# EAGLE design pcbremote (EAGLE 9.6.2)
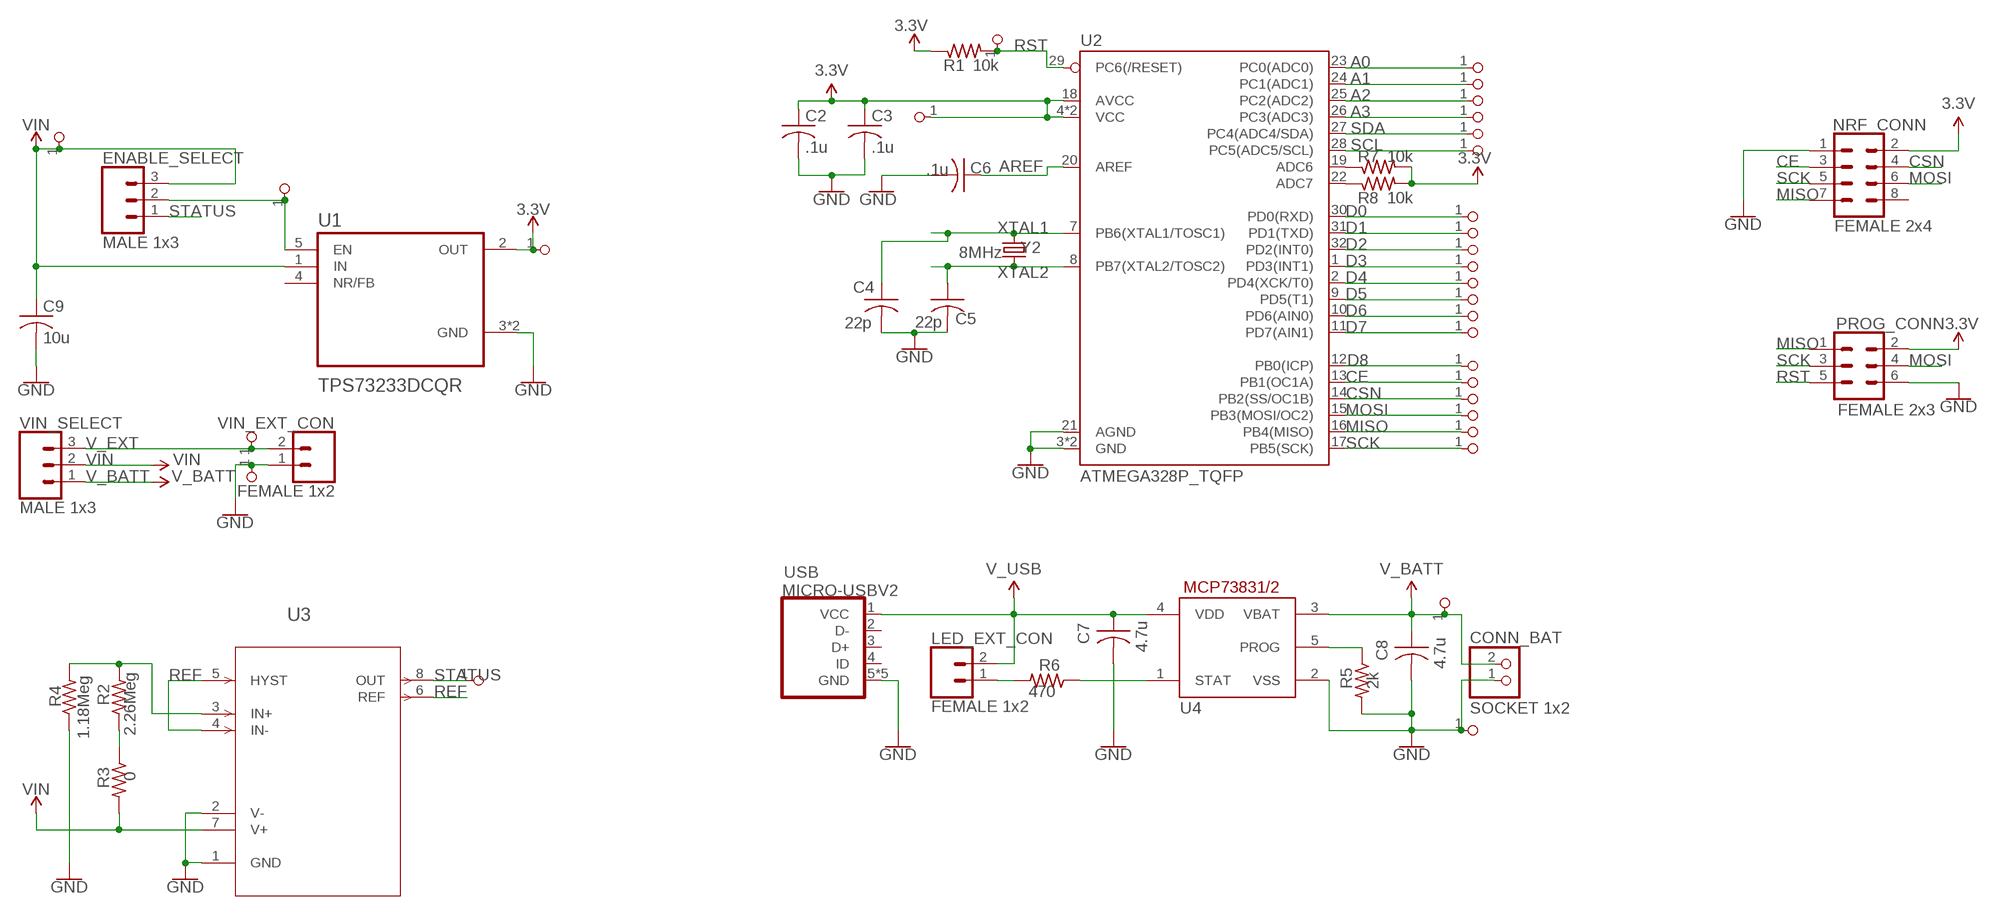
[diagram p0: schematic, sheet 1]

## Parts
3.3V  PINHD-1X1  [1X01]
A0  PINHD-1X1  [1X01]
A1  PINHD-1X1  [1X01]
A2  PINHD-1X1  [1X01]
A3  PINHD-1X1  [1X01]
C2  .1u  C-USC0805  [C0805]
C3  .1u  C-USC0805  [C0805]
C4  22p  C-USC0805  [C0805]
C5  22p  C-USC0805  [C0805]
C6  .1u  C-USC0805  [C0805]
C7  4.7u  C-USC0805  [C0805]
C8  4.7u  C-USC0805  [C0805]
C9  10u  C-USC0805  [C0805]
CE  PINHD-1X1  [1X01]
CONN_BAT  SOCKET 1x2  JST_2PIN-THM  [JST-PH-2-THM]
CSN  PINHD-1X1  [1X01]
D0  PINHD-1X1  [1X01]
D1  PINHD-1X1  [1X01]
D2  PINHD-1X1  [1X01]
D3  PINHD-1X1  [1X01]
D4  PINHD-1X1  [1X01]
D5  PINHD-1X1  [1X01]
D6  PINHD-1X1  [1X01]
D7  PINHD-1X1  [1X01]
D8  PINHD-1X1  [1X01]
EN  PINHD-1X1  [1X01]
ENABLE_SELECT  MALE 1x3  CONN_03  [1X03]
GND  PINHD-1X1  [1X01]
GND7  PINHD-1X1  [1X01]
LED_EXT_CON  FEMALE 1x2  CONN_02  [1X02]
MISO  PINHD-1X1  [1X01]
MOSI  PINHD-1X1  [1X01]
NRF_CONN  FEMALE 2x4  CONN_04X2  [2X4]
PROG_CONN  FEMALE 2x3  CONN_03X2FEMALE  [2X3]
R1  10k  R-US_R0805  [R0805]
R2  2.26Meg  R-US_R0805  [R0805]
R3  0  R-US_R0805  [R0805]
R4  1.18Meg  R-US_R0805  [R0805]
R5  2k  R-US_R0805  [R0805]
R6  470  R-US_R0805  [R0805]
R7  10k  R-US_R0805  [R0805]
R8  10k  R-US_R0805  [R0805]
RESET  PINHD-1X1  [1X01]
SCK  PINHD-1X1  [1X01]
SCL  PINHD-1X1  [1X01]
SDA  PINHD-1X1  [1X01]
STATUS  PINHD-1X1  [1X01]
U1  TPS73233DCQR  [SOT127P706X180-6N]
U2  ATMEGA328P_TQFP  [TQFP32-08]
U3  LTC1540CS8PBF  [SO-8_S_LIT]
U4  MCP73831/OT  [SOT23-5L]
USB  MICRO-USBV2  [MICRO-USB-2]
V_BATT  PINHD-1X1  [1X01]
VCC  PINHD-1X1  [1X01]
VIN  PINHD-1X1  [1X01]
VIN_EXT  PINHD-1X1  [1X01]
VIN_EXT_CON  FEMALE 1x2  CONN_02  [1X02]
VIN_SELECT  MALE 1x3  CONN_03  [1X03]
Y2  8MHz  CRYSTAL-8MHZSMD-5X3.2  [CRYSTAL-SMD-5X3.2-4PAD]

## Nets
3.3V: 3.3V.1 C2.1 C3.1 NRF_CONN.2 PROG_CONN.2 R1.1 R7.2 R8.2 U1.2(OUT) U2.4(VCC) U2.6(VCC) U2.18(AVCC) VCC.1
A0: A0.1 U2.23(PC0(ADC0))
A1: A1.1 U2.24(PC1(ADC1))
A2: A2.1 U2.25(PC2(ADC2))
A3: A3.1 U2.26(PC3(ADC3))
AREF: C6.1 U2.20(AREF)
CE: CE.1 NRF_CONN.3 U2.13(PB1(OC1A))
CSN: CSN.1 NRF_CONN.4 U2.14(PB2(SS/OC1B))
D0: D0.1 U2.30(PD0(RXD))
D1: D1.1 U2.31(PD1(TXD))
D2: D2.1 U2.32(PD2(INT0))
D3: D3.1 U2.1(PD3(INT1))
D4: D4.1 U2.2(PD4(XCK/T0))
D5: D5.1 U2.9(PD5(T1))
D6: D6.1 U2.10(PD6(AIN0))
D7: D7.1 U2.11(PD7(AIN1))
D8: D8.1 U2.12(PB0(ICP))
GND: C2.2 C3.2 C4.2 C5.2 C6.2 C7.2 C8.2 C9.2 CONN_BAT.1 GND7.1 GND.1 NRF_CONN.1 PROG_CONN.6 R4.1 R5.2 U1.3(GND) U1.6(GND) U2.3(GND) U2.5(GND) U2.21(AGND) U3.1(GND) U3.2(V-) U4.2(VSS) USB.5(GND) USB.P$1(GND) USB.P$2(GND) USB.P$3(GND) USB.P$4(GND) VIN_EXT_CON.1
MISO: MISO.1 NRF_CONN.7 PROG_CONN.1 U2.16(PB4(MISO))
MOSI: MOSI.1 NRF_CONN.6 PROG_CONN.4 U2.15(PB3(MOSI/OC2))
N$1: R2.2 R4.2 U3.3(IN+)
N$2: R2.1 R3.1
N$3: R5.1 U4.5(PROG)
N$4: R6.1 U4.1(STAT)
N$5: LED_EXT_CON.1 R6.2
N$6: R7.1 U2.19(ADC6)
N$7: R8.1 U2.22(ADC7)
N$8: EN.1 ENABLE_SELECT.2 U1.5(EN)
REF: U3.4(IN-) U3.5(HYST) U3.6(REF)
RST: PROG_CONN.5 R1.2 RESET.1 U2.29(PC6(/RESET))
SCK: NRF_CONN.5 PROG_CONN.3 SCK.1 U2.17(PB5(SCK))
SCL: SCL.1 U2.28(PC5(ADC5/SCL))
SDA: SDA.1 U2.27(PC4(ADC4/SDA))
STATUS: ENABLE_SELECT.1 STATUS.1 U3.8(OUT)
V_BATT: C8.1 CONN_BAT.2 U4.3(VBAT) V_BATT.1 VIN_SELECT.1
V_EXT: VIN_EXT.1 VIN_EXT_CON.2 VIN_SELECT.3
V_USB: C7.1 LED_EXT_CON.2 U4.4(VDD) USB.1(VCC)
VIN: C9.1 ENABLE_SELECT.3 R3.2 U1.1(IN) U3.7(V+) VIN.1 VIN_SELECT.2
XTAL1: C4.1 U2.7(PB6(XTAL1/TOSC1)) Y2.1
XTAL2: C5.1 U2.8(PB7(XTAL2/TOSC2)) Y2.3
Unconnected: NRF_CONN.8 U1.4(NR/FB) USB.2(D-) USB.3(D+) USB.4(ID)

## Library data of the parts
3.3V A0 A1-A3 CE CSN D0 D1-D8 EN GND GND7 MISO MOSI RESET SCK SCL SDA STATUS V_BATT VCC VIN VIN_EXT = pinhead:PINHD-1X1: PIN HEADER
C2-C9 = rcl:C-US: CAPACITOR, American symbol; SPICEPREFIX: C
CONN_BAT = adafruit:JST_2PIN: JST 2-Pin Connectors of various flavors SMT-RA (S2B-PH-SM4) 4UConnector #17311 SMT (B2B-PH-SM4) THM-RA (S2B-PH) THM (B2B-PH)
ENABLE_SELECT VIN_SELECT = SparkFun-Connectors:CONN_03: Multi connection point. Often used as Generic Header-pin footprint for 0.1 inch spaced/style header connections On any of the 0.1 inch spaced packages, you can populate with these: Break Away Headers - Straight <https://www.sparkfun.com/products/116> (PRT-00116) Break Away Male Headers - Right Angle <https://www.sparkfun.com/products/553> (PRT-00553) Female Headers <https://www.sparkfun.com/products/115> (PRT-00115) Break Away Headers - Machine Pin <https://www.sparkfun.com/products/117> (PRT-00117) Break Away Female Headers - Swiss Machine Pin <https://www.sparkfun.com/products/743> (PRT-00743) Stackable Header - 3 Pin (Female, 0.1") <https://www.sparkfun.com/products/13875> (PRT-13875) For SCREWTERMINALS and SPRING TERMINALS visit here: Screw Terimnals on SparkFun.com <https://www.sparkfun.com/search/results?term=Screw+Terminals> (5mm/3.5mm/2.54mm spacing) This device is also useful as a general connection point to wire up your design to another part of your project. Our various solder wires solder well into these plated through hole pads. Hook-Up Wire - Assortment (Stranded, 22 AWG) <https://www.sparkfun.com/products/11375> (PRT-11375) Hook-Up Wire - Assortment (Solid Core, 22 AWG) <https://www.sparkfun.com/products/11367> (PRT-11367) View the entire wire category on our website here <https://www.sparkfun.com/categories/141> Special notes: Molex polarized connector foot print use with SKU : PRT-08232 with associated crimp pins and housings.; PROD_ID: XXX-00000; VALUE: 455-1750-1-ND
LED_EXT_CON VIN_EXT_CON = SparkFun-Retired:CONN_02: Multi connection point. Often used as Generic Header-pin footprint for 0.1 inch spaced/style header connections On any of the 0.1 inch spaced packages, you can populate with these: Break Away Headers - Straight <https://www.sparkfun.com/products/116> (PRT-00116) Break Away Male Headers - Right Angle <https://www.sparkfun.com/products/553> (PRT-00553) Female Headers <https://www.sparkfun.com/products/115> (PRT-00115) Break Away Headers - Machine Pin <https://www.sparkfun.com/products/117> (PRT-00117) Break Away Female Headers - Swiss Machine Pin <https://www.sparkfun.com/products/743> (PRT-00743) For SCREWTERMINALS and SPRING TERMINALS visit here: Screw Terimnals on SparkFun.com <https://www.sparkfun.com/search/results?term=Screw+Terminals> (5mm/3.5mm/2.54mm spacing) This device is also useful as a general connection point to wire up your design to another part of your project. Our various solder wires solder well into these plated through hole pads. Hook-Up Wire - Assortment (Stranded, 22 AWG) <https://www.sparkfun.com/products/11375> (PRT-11375) Hook-Up Wire - Assortment (Solid Core, 22 AWG) <https://www.sparkfun.com/products/11367> (PRT-11367) View the entire wire category on our website here <https://www.sparkfun.com/categories/141> Special notes: Molex polarized connector foot print use with: PRT-08233 with associated crimp pins and housings. 2.54_SCREWTERM for use with PRT-10571. 3.5mm Screw Terminal footprints for PRT-08084 5mm Screw Terminal footprints for use with PRT-08432
NRF_CONN = SparkFun-Connectors:CONN_04X2: Multi connection point. Often used as Generic Header-pin footprint for 0.1 inch spaced/style header connections On any of the 0.1 inch spaced packages, you can populate with these: Break Away Headers - Straight <https://www.sparkfun.com/products/116> (PRT-00116) Break Away Male Headers - Right Angle <https://www.sparkfun.com/products/553> (PRT-00553) Female Headers <https://www.sparkfun.com/products/115> (PRT-00115) Break Away Headers - Machine Pin <https://www.sparkfun.com/products/117> (PRT-00117) Break Away Female Headers - Swiss Machine Pin <https://www.sparkfun.com/products/743> (PRT-00743)
PROG_CONN = SparkFun-Connectors:CONN_03X2: Multi connection point. Often used as Generic Header-pin footprint for 0.1 inch spaced/style header connections You can populate with any combo of single row headers, but if you'd like an exact match, check these: Header - 2x3 (Male, 0.1") <https://www.sparkfun.com/products/12807> (PRT-12807) Header - 2x3 (Female, 0.1") <https://www.sparkfun.com/products/13010> (PRT-13010) 2x3 Pin Shrouded Header <https://www.sparkfun.com/products/10877> (PRT-10877) On any of the 0.1 inch spaced packages, you can populate with these: Break Away Headers - Straight <https://www.sparkfun.com/products/116> (PRT-00116) Break Away Male Headers - Right Angle <https://www.sparkfun.com/products/553> (PRT-00553) Female Headers <https://www.sparkfun.com/products/115> (PRT-00115) Break Away Headers - Machine Pin <https://www.sparkfun.com/products/117> (PRT-00117) Break Away Female Headers - Swiss Machine Pin <https://www.sparkfun.com/products/743> (PRT-00743) Special note: the shrouded connector mates well with our 3x2 ribbon cables: Ribbon Crimp Connector - 6-pin (2x3, Female) <https://www.sparkfun.com/products/10651> (PRT-10651) Ribbon Cable - 6 wire (15ft) <https://www.sparkfun.com/products/10646> (PRT-10646); PROD_ID: CONN-11566
R1-R8 = rcl:R-US_: RESISTOR, American symbol; SPICEPREFIX: R
U1 = TPS73233DCQR:TPS73233DCQR; DESCRIPTION: 250-mA, high-accuracy, ultra-low-dropout voltage regulator with reverse current protection & enable 6-SOT-223 -40 to 125; DIGI-KEY_PART_NUMBER: 296-16866-1-ND; MF: Texas Instruments; MP: TPS73233DCQR; PACKAGE: SOT-223-6 Texas Instruments; PURCHASE-URL: https://pricing.snapeda.com/search/part/TPS73233DCQR/?ref=eda
U2 = SparkFun-IC-Microcontroller:ATMEGA328P_TQFP: Popular 328P in QFP Storefront component: ATmega328 - TQFP <https://www.sparkfun.com/products/13448> (COM-13448) Datasheet <http://www.sparkfun.com/datasheets/Components/SMD/ATMega328.pdf> SparkFun Products SparkFun RedBoard - Programmed with Arduino <https://www.sparkfun.com/products/12757> (DEV-12757) Arduino Pro Mini 328 - 5V/16MHz <https://www.sparkfun.com/products/11113> (DEV-11113) Arduino Pro Mini 328 - 3.3V/8MHz <https://www.sparkfun.com/products/11114> (DEV-11114) SparkFun OpenLog <https://www.sparkfun.com/products/13712> (DEV-13712) SparkFun MicroView - OLED Arduino Module <https://www.sparkfun.com/products/12923> (DEV-12923) SparkFun Digital Sandbox <https://www.sparkfun.com/products/12651> (DEV-12651) SparkFun PicoBoard <https://www.sparkfun.com/products/11888> (WIG-11888) Arduino Fio <https://www.sparkfun.com/products/10116> (DEV-10116) LilyPad Arduino 328 Main Board <https://www.sparkfun.com/products/13342> (DEV-13342) SparkFun RedStick <https://www.sparkfun.com/products/13741> (DEV-13741) LilyPad MP3 <https://www.sparkfun.com/products/11013> (DEV-11013) LilyPad Arduino SimpleSnap <https://www.sparkfun.com/products/10941> (DEV-10941) SparkFun Stepoko <https://www.sparkfun.com/products/13899> (ROB-13899) SparkFun Geiger Counter <https://www.sparkfun.com/products/11345> (SEN-11345) SparkFun EL Sequencer <https://www.sparkfun.com/products/12781> (COM-12781) Arduino Pro 328 - 5V/16MHz <https://www.sparkfun.com/products/10915> (DEV-10915) CryptoCape <https://www.sparkfun.com/products/12773> (DEV-12773) SparkFun IR Thermometer Evaluation Board - MLX90614 <https://www.sparkfun.com/products/10740> (SEN-10740) SparkFun RedBot Mainboard <https://www.sparkfun.com/products/12097> (ROB-12097) Arduino Pro 328 - 3.3V/8MHz <https://www.sparkfun.com/products/10914> (DEV-10914) SparkFun Block for Intel® Edison - Arduino <https://www.sparkfun.com/products/13036> (DEV-13036) SparkFun Simon Says - Surface Mount Soldering Kit <https://www.sparkfun.com/products/10935> (KIT-10935) SparkFun 7-Segment Serial Display - Red <https://www.sparkfun.com/products/11441> (COM-11441) SparkFun 7-Segment Serial Display - White <https://www.sparkfun.com/products/11629> (COM-11629) SparkFun 7-Segment Serial Display - Yellow <https://www.sparkfun.com/products/11443> (COM-11443) SparkFun 7-Segment Serial Display - Kelly Green <https://www.sparkfun.com/products/11440> (COM-11440) SparkFun 7-Segment Serial Display - Blue <https://www.sparkfun.com/products/11442> (COM-11442) SparkFun OpenSegment Serial Display - 20mm (Blue) <https://www.sparkfun.com/products/11647> (COM-11647) SparkFun OpenSegment Serial Display - 20mm (Green) <https://www.sparkfun.com/products/11646> (COM-11646) SparkFun OpenSegment Serial Display - 20mm (White) <https://www.sparkfun.com/products/11648> (COM-11648) SparkFun OpenSegment Serial Display - 20mm (Red) <https://www.sparkfun.com/products/11644> (COM-11644) SparkFun OpenSegment Serial Display - 20mm (Yellow) <https://www.sparkfun.com/products/11645> (COM-11645) SparkFun OpenSegment Shield <https://www.sparkfun.com/products/13190> (DEV-13190); PROD_ID: IC-09069
U3 = LTC_1450:LTC1540CS8PBF; BUILT_BY: EMA_UL_Team; MANUFACTURER_PART_NUMBER: ltc1540cs8#pbf; SOURCELIBRARY: LinearTech_2016_03_08; VENDOR: Linear Technology
U4 = adafruit:MCP73831: MCP73831/2 Miniature Single-Cell, Fully Integrated Li-Ion, Li-Polymer Charge Management Controllers. Nice and small simple lipoly charge controller, with adjustable current and status output (LED) http://www.ladyada.net/library/pcb/eaglelibrary.html
USB = microusb:MICRO-USB: Micro USB B connector
Y2 = SparkFun-Clocks:CRYSTAL-8MHZ: 8MHz Crystal Datasheet Example <http://www.futureelectronics.com/en/technologies/electromechanical/timing-devices/crystals/Pages/6008189-ABM3B-8.000MHZ-B2-T.aspx?IM=0> Frequency: 8MHz Frequency Tolerance: ±20ppm Load Capacitance: 18pF SparkFun Products: Pro Micro -3.3V/8MHz <https://www.sparkfun.com/products/12587> WAV Trigger <https://www.sparkfun.com/products/13660>; PROD_ID: XTAL-09431

## Board
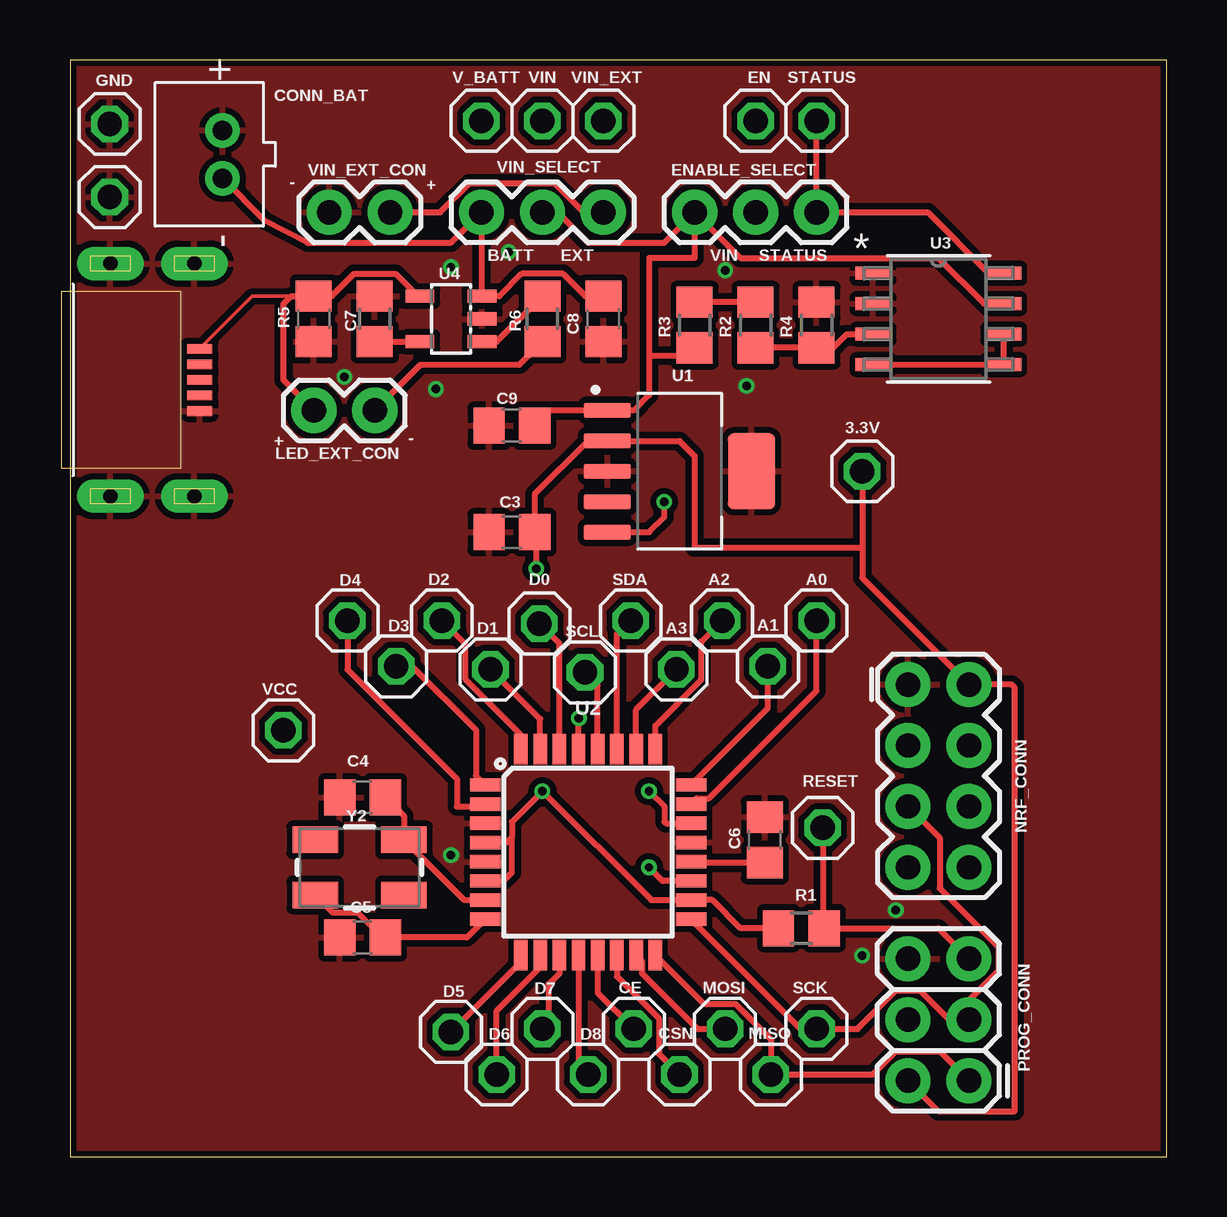
[diagram p1: board, top side]
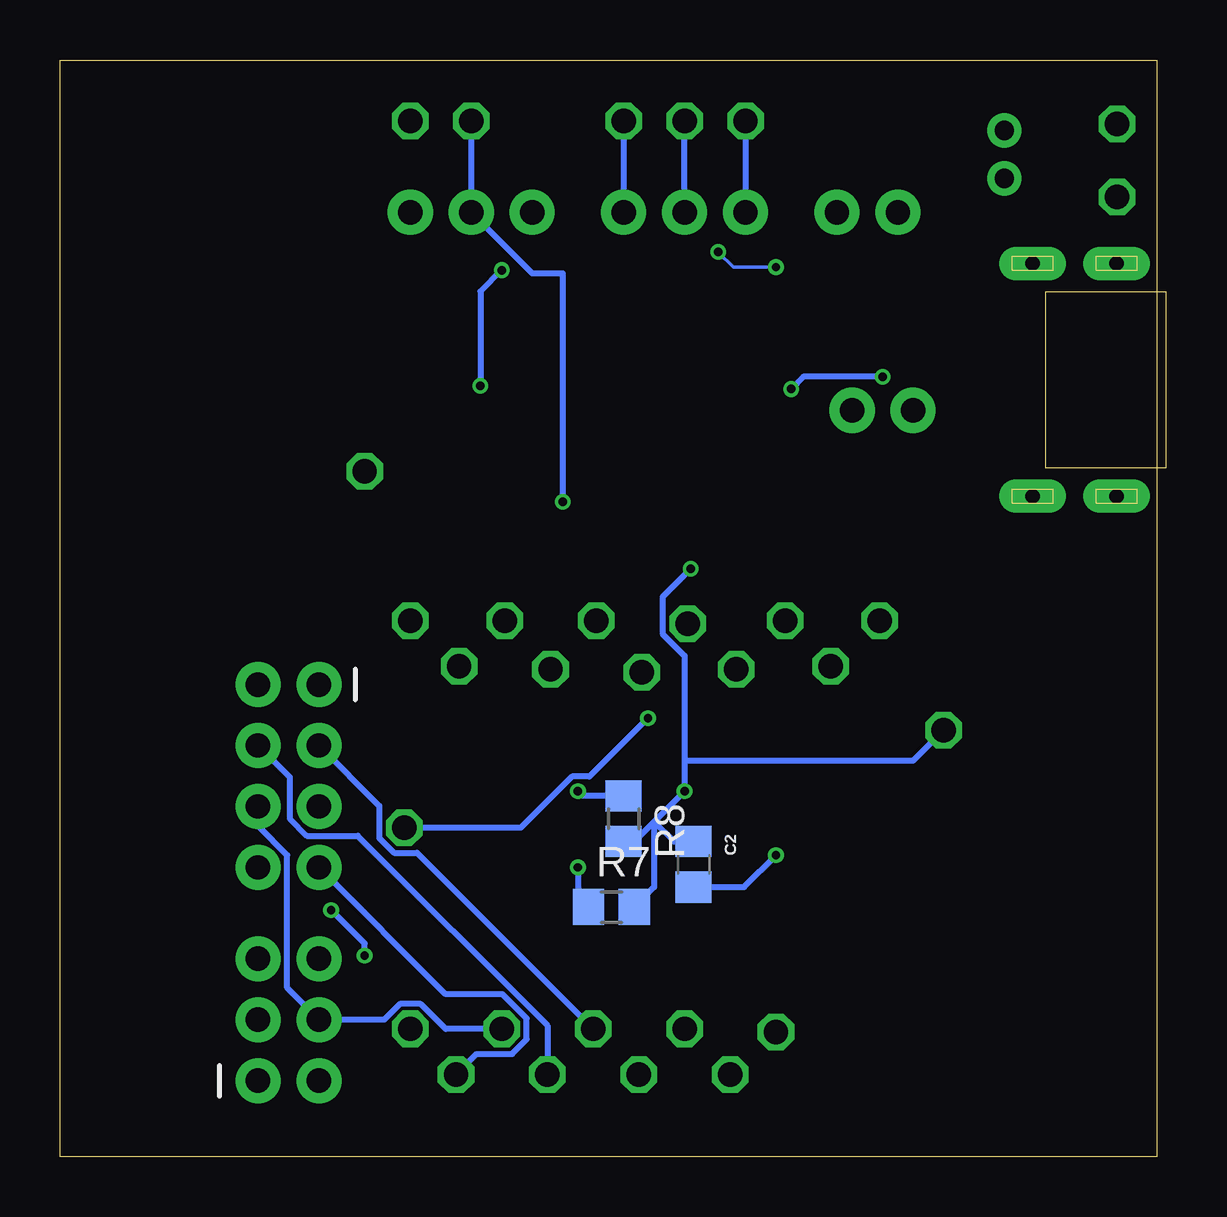
[diagram p2: board, bottom side, seen from below]

Size 45.72 x 45.72 mm. Coordinates in mm from the lower left corner, seen from the top.
Outline: 0,0 45.72,0 45.72,45.72 0,45.72 0,0
Copper layers (1*16): Top 0.035mm / dielectric 1.5mm / Bottom 0.035mm
Design rules "PCBWay_2layer": minimum track width 6mil, minimum drill 0.3mm, track to track 6mil, track to pad 6mil, pad to pad 6mil, via to via 6mil, smd to smd 4mil, copper to edge 10mil, drill to drill 6mil, minimum pad ring 6mil, minimum via ring 6mil, stop-mask expansion 4mil, vias tented up to drill 0.8mm, thermal gap 10mil

### Footprints (pad centres in the part's own frame; a part is rotated, then mirrored left to right if it is on the bottom)
1X01 = drill 1.016 octagon: 1 0,0
C0805 = smd 1.3 x 1.5: 1 -0.95,0; 2 0.95,0
JST-PH-2-THM = drill 0.8 pad 1.422: 1 1,0; 2 -1,0
1X03 = drill 1.016 pad 1.88: 1 0,0; 2 2.54,0; 3 5.08,0
1X02 = drill 1.016 pad 1.88: 1 0,0; 2 2.54,0
2X4 = drill 1.016 pad 1.88: 1 -3.81,-1.27; 2 -3.81,1.27; 3 -1.27,-1.27; 4 -1.27,1.27; 5 1.27,-1.27; 6 1.27,1.27; 7 3.81,-1.27; 8 3.81,1.27
2X3 = drill 1.016 pad 1.88: 1 0,0; 2 0,2.54; 3 2.54,0; 4 2.54,2.54; 5 5.08,0; 6 5.08,2.54
R0805 = smd 1.3 x 1.5: 1 -0.95,0; 2 0.95,0
SOT127P706X180-6N = smd 1.97 x 0.62: 1 -3.005,2.54; 2 -3.005,1.27; 3 -3.005,0; 4 -3.005,-1.27; 5 -3.005,-2.54 | smd 1.97 x 3.16: 6 3.005,0
TQFP32-08 = smd 1.27 x 0.559: 1 -4.293,2.8; 2 -4.293,2; 3 -4.293,1.2; 4 -4.293,0.4; 5 -4.293,-0.4; 6 -4.293,-1.2; 7 -4.293,-2; 8 -4.293,-2.8; 17 4.293,-2.8; 18 4.293,-2; 19 4.293,-1.2; 20 4.293,-0.4; 21 4.293,0.4; 22 4.293,1.2; 23 4.293,2; 24 4.293,2.8 | smd 0.559 x 1.27: 9 -2.8,-4.293; 10 -2,-4.293; 11 -1.2,-4.293; 12 -0.4,-4.293; 13 0.4,-4.293; 14 1.2,-4.293; 15 2,-4.293; 16 2.8,-4.293; 25 2.8,4.293; 26 2,4.293; 27 1.2,4.293; 28 0.4,4.293; 29 -0.4,4.293; 30 -1.2,4.293; 31 -2,4.293; 32 -2.8,4.293
SO-8_S_LIT = smd 1.46 x 0.533: 1 -2.724,1.905; 2 -2.724,0.635; 3 -2.724,-0.635; 4 -2.724,-1.905; 5 2.724,-1.905; 6 2.724,-0.635; 7 2.724,0.635; 8 2.724,1.905
SOT23-5L = smd 0.55 x 1.2: 1 -0.95,-1.3; 2 0,-1.3; 3 0.95,-1.3; 4 0.95,1.3; 5 -0.95,1.3
MICRO-USB-2 = smd 0.4 x 1.05: 1 -1.3,5.275; 2 -0.65,5.275; 3 0,5.275; 4 0.65,5.275; 5 1.3,5.275 | drill 0.6 pad 1.4 long: P$1 -4.85,5.05; P$2 -4.85,1.55; P$3 4.85,5.05; P$4 4.85,1.55
CRYSTAL-SMD-5X3.2-4PAD = smd 1.9 x 1.1: 1 -1.85,-1.15; 2 1.85,-1.15; 3 1.85,1.15; 4 -1.85,1.15

### Placement (x,y rotation side)
3.3V  33.02,28.58 0 top
A0  31.11,22.35 180 top
A1  29.08,20.45 180 top
A2  27.18,22.35 180 top
A3  25.27,20.32 180 top
C2  19.3,12.19 270 bottom
C3  18.41,26.03 180 top
C4  12.19,14.99 180 top
C5  12.19,9.14 180 top
C6  28.96,13.21 90 top
C7  10.16,34.92 270 top
C8  22.23,34.92 270 top
C9  18.41,30.48 180 top
CE  23.5,5.33 180 top
CONN_BAT  6.35,41.78 90 top
CSN  25.4,3.43 180 top
D0  19.56,22.23 180 top
D1  17.53,20.32 180 top
D2  15.49,22.35 180 top
D3  13.59,20.45 0 top
D4  11.56,22.35 0 top
D5  15.88,5.21 0 top
D6  17.78,3.43 0 top
D7  19.68,5.33 0 top
D8  21.59,3.43 0 top
EN  28.57,43.18 0 top
ENABLE_SELECT  31.11,39.37 180 top
GND  1.65,40 0 top
GND7  1.65,43.05 0 top
LED_EXT_CON  12.7,31.12 180 top
MISO  29.21,3.43 180 top
MOSI  27.3,5.33 180 top
NRF_CONN  36.2,15.88 270 top
PROG_CONN  37.47,3.17 90 top
R1  30.48,9.53 0 top
R2  28.57,34.67 270 top
R3  26.04,34.67 270 top
R4  31.11,34.67 270 top
R5  12.7,34.92 90 top
R6  19.68,34.92 270 top
R7  22.73,10.41 0 bottom
R8  22.23,14.1 270 bottom
RESET  31.37,13.72 0 top
SCK  31.11,5.33 180 top
SCL  21.46,20.19 180 top
SDA  23.37,22.35 180 top
STATUS  31.11,43.18 0 top
U1  25.4,28.58 0 top
U2  21.59,12.7 0 top
U3  36.2,34.92 0 top
U4  15.88,34.92 90 top
USB  0.13,32.38 270 top
V_BATT  17.14,43.18 0 top
VCC  8.89,17.78 180 top
VIN  19.68,43.18 0 top
VIN_EXT  22.23,43.18 0 top
VIN_EXT_CON  10.79,39.37 0 top
VIN_SELECT  17.14,39.37 0 top
Y2  12.06,12.07 180 top

### Tracks (layer width: path | path; a pad name or v marks a point on that pad's centre or on a via)
3.3V  (via drill 0.35)
  Top 0.254: v19.43,24.51 19.43,25.97 C3.1 19.36,27.62 21.59,29.84 U1.2 25.4,29.84 26.04,29.21 26.04,25.4 33.02,25.4 3.3V.1 33.02,24.13 NRF_CONN.2 39.24,19.69 39.37,19.56 39.37,1.91 36.2,1.91 PROG_CONN.2 | 18.41,13.34 18.41,13.97 v19.68,15.24 24.23,10.7 U2.18 26.77,10.7 27.94,9.53 R1.1 | 18.41,13.34 18.18,13.1 U2.4 | U2.6 18.06,11.5 18.41,11.85 18.41,13.34
  Bottom 0.254: 19.68,16.51 19.68,20.88 20.6,21.79 20.6,23.34 v19.43,24.51 | 19.68,16.51 v19.68,15.24 20.95,13.97 | 20.95,13.97 21.78,13.15 R8.2 | 20.95,13.97 20.13,13.14 C2.1 | 20.95,13.97 20.95,11.24 R7.2 | VCC.1 10.16,16.51 19.68,16.51
A0
  Top 0.254: U2.23 26.12,14.94 26.63,14.94 31.11,19.42 A0.1
A1
  Top 0.254: U2.24 29.08,18.7 A1.1
A2
  Top 0.254: A2.1 26.31,21.49 26.31,19.89 24.39,17.96 U2.25
A3
  Top 0.254: U2.26 23.59,18.64 A3.1
AREF
  Top 0.254: C6.1 25.93,12.26 U2.20
CE
  Top 0.254: U2.13 21.99,6.84 CE.1
  Bottom 0.254: NRF_CONN.3 32.41,14.63 32.41,13.29 31.8,12.68 30.84,12.68 CE.1
CSN
  Top 0.254: CSN.1 24.54,4.29 24.54,5.77 22.79,7.51 U2.14
  Bottom 0.254: NRF_CONN.4 36.14,15.82 36.14,14.1 35.43,13.39 33.31,13.39 25.4,5.48 CSN.1
D0
  Top 0.254: U2.30 20.39,21.39 D0.1
D1
  Top 0.254: U2.31 19.59,18.26 D1.1
D2
  Top 0.254: D2.1 16.48,21.36 16.48,19.89 18.79,17.58 U2.32
D3
  Top 0.254: U2.1 16.92,15.88 16.92,17.79 14.26,20.45 D3.1
D4
  Top 0.254: D4.1 11.56,20.32 | 11.56,20.32 11.56,20.31 | U2.2 17.17,14.7 17.07,14.61 16.13,14.61 16.13,15.75 11.56,20.32
D5
  Top 0.254: U2.9 18.79,8.12 D5.1
D6
  Top 0.254: U2.10 19.6,8.39 19.6,7.91 17.78,6.09 D6.1
D7
  Top 0.254: U2.11 20.4,8.39 20.4,7.66 19.94,7.19 19.94,5.59 D7.1
D8
  Top 0.254: U2.12 21.19,3.83 D8.1
GND  (via drill 0.35)
  Bottom 0.152: v15.88,37.08 17.65,37.08 v18.29,37.72
  Bottom 0.254: v33.02,8.38 33.02,8.89 v34.42,10.29 | v27.3,36.96 28.19,36.07 v28.19,32.13 | v11.43,32.51 14.73,32.51 v15.24,32 | C2.2 17.21,11.24 v15.88,12.57
  pour Top (isolate 0.254): -0.64,46.35 -0.64,-0.63 46.35,-0.63 46.35,46.35
MISO
  Top 0.254: U2.16 26.42,6.38 27.74,6.38 29.21,4.9 MISO.1 33.45,3.43 34.42,4.39 36.25,4.39 PROG_CONN.1
  Bottom 0.254: NRF_CONN.7 29.64,6.78 27.28,6.78 26.26,5.77 26.26,4.9 26.87,4.29 28.35,4.29 MISO.1
MOSI
  Top 0.254: U2.15 23.83,8.17 23.83,7.66 26.15,5.33 MOSI.1
  Bottom 0.254: MOSI.1 29.64,5.33 30.68,6.38 31.55,6.38 32.21,5.71 PROG_CONN.4 36.25,7.04 36.25,12.57 37.47,13.79 NRF_CONN.6
N$1
  Top 0.254: R2.2 R4.2 31.82,33.72 32.38,34.29 U3.3
N$2
  Top 0.254: R2.1 R3.1
N$3
  Top 0.254: U4.5 14.57,34 14.55,33.98 R5.1
N$4
  Top 0.254: R6.1 17.79,33.98 U4.1
N$5
  Top 0.254: LED_EXT_CON.1 14.61,33.02 18.73,33.02 R6.2
N$6  (via drill 0.35)
  Top 0.254: U2.19 24.7,11.5 v24.13,12.07
  Bottom 0.254: v24.13,12.07 24.13,10.86 R7.1
N$7  (via drill 0.35)
  Top 0.254: v24.13,15.24 24.77,14.61 24.77,13.97 24.84,13.9 U2.22
  Bottom 0.254: R8.1 23.94,15.05 v24.13,15.24
N$8  (via drill 0.35)
  Top 0.254: U1.5 24.13,26.03 24.77,26.67 v24.77,27.3
  Bottom 0.254: v24.77,27.3 24.77,36.83 26.04,36.83 ENABLE_SELECT.2 EN.1
REF
  Top 0.254: U3.4 U3.5 U3.6
RST  (via drill 0.35)
  Top 0.254: U2.29 21.19,18.27 v21.21,18.29 | RESET.1 31.37,9.59 R1.2 36.2,9.53 PROG_CONN.5
  Bottom 0.254: v21.21,18.29 23.65,15.85 24.38,15.85 26.51,13.72 RESET.1
SCK
  Top 0.254: U2.17 30.45,5.33 SCK.1 32.82,5.33 34.42,6.93 35.43,6.93 36.65,5.71 PROG_CONN.3 37.47,6.53 38.68,7.75 38.68,8.76 36.25,11.2 36.25,13.28 NRF_CONN.5
SCL
  Top 0.254: U2.28 21.99,19.67 SCL.1
SDA
  Top 0.254: U2.27 22.79,21.77 SDA.1
STATUS
  Top 0.254: U3.8 38.28,36.83 35.74,39.37 ENABLE_SELECT.1 STATUS.1
V_BATT
  Top 0.254: C8.1 21.48,35.88 20.55,36.8 18.82,36.8 17.89,35.88 U4.3 17.14,35.91 VIN_SELECT.1 15.88,38.1 9.89,38.1 8.1,39.03 CONN_BAT.2
  Bottom 0.254: V_BATT.1 VIN_SELECT.1
V_EXT
  Top 0.254: VIN_EXT_CON.2 15.42,39.37 16.64,40.59 20.19,40.59 21.41,39.37 VIN_SELECT.3
  Bottom 0.254: VIN_EXT.1 VIN_SELECT.3
V_USB
  Top 0.152: USB.1 7.59,35.88 9.53,35.88
  Top 0.254: U4.4 14.49,35.88 13.57,36.8 11.83,36.8 10.9,35.88 C7.1 9.53,35.88 9.21,35.88 8.89,35.56 8.89,32.38 LED_EXT_CON.2
VIN
  Top 0.254: VIN_SELECT.2 20,39.69 21.59,38.1 24.77,38.1 ENABLE_SELECT.3 | C9.1 20,31.12 U1.1 23.5,31.12 24.13,31.75 24.13,33.4 | ENABLE_SELECT.3 27.94,37.46 36.2,37.46 38.1,35.56 U3.7 | ENABLE_SELECT.3 26.04,37.46 24.13,37.46 24.13,33.4 | 24.13,33.4 25.84,33.4 26.04,33.59 R3.2
  Bottom 0.254: VIN_SELECT.2 VIN.1
XTAL1
  Top 0.254: C4.1 13.91,14.21 Y2.1 16.43,10.7 U2.7
XTAL2
  Top 0.254: U2.8 16.54,9.14 C5.1 13.04,9.14 12.01,10.17 10.96,10.17 Y2.3

### Text on the board
tNames: - | + | BATT | EXT | VIN | STATUS | + | -